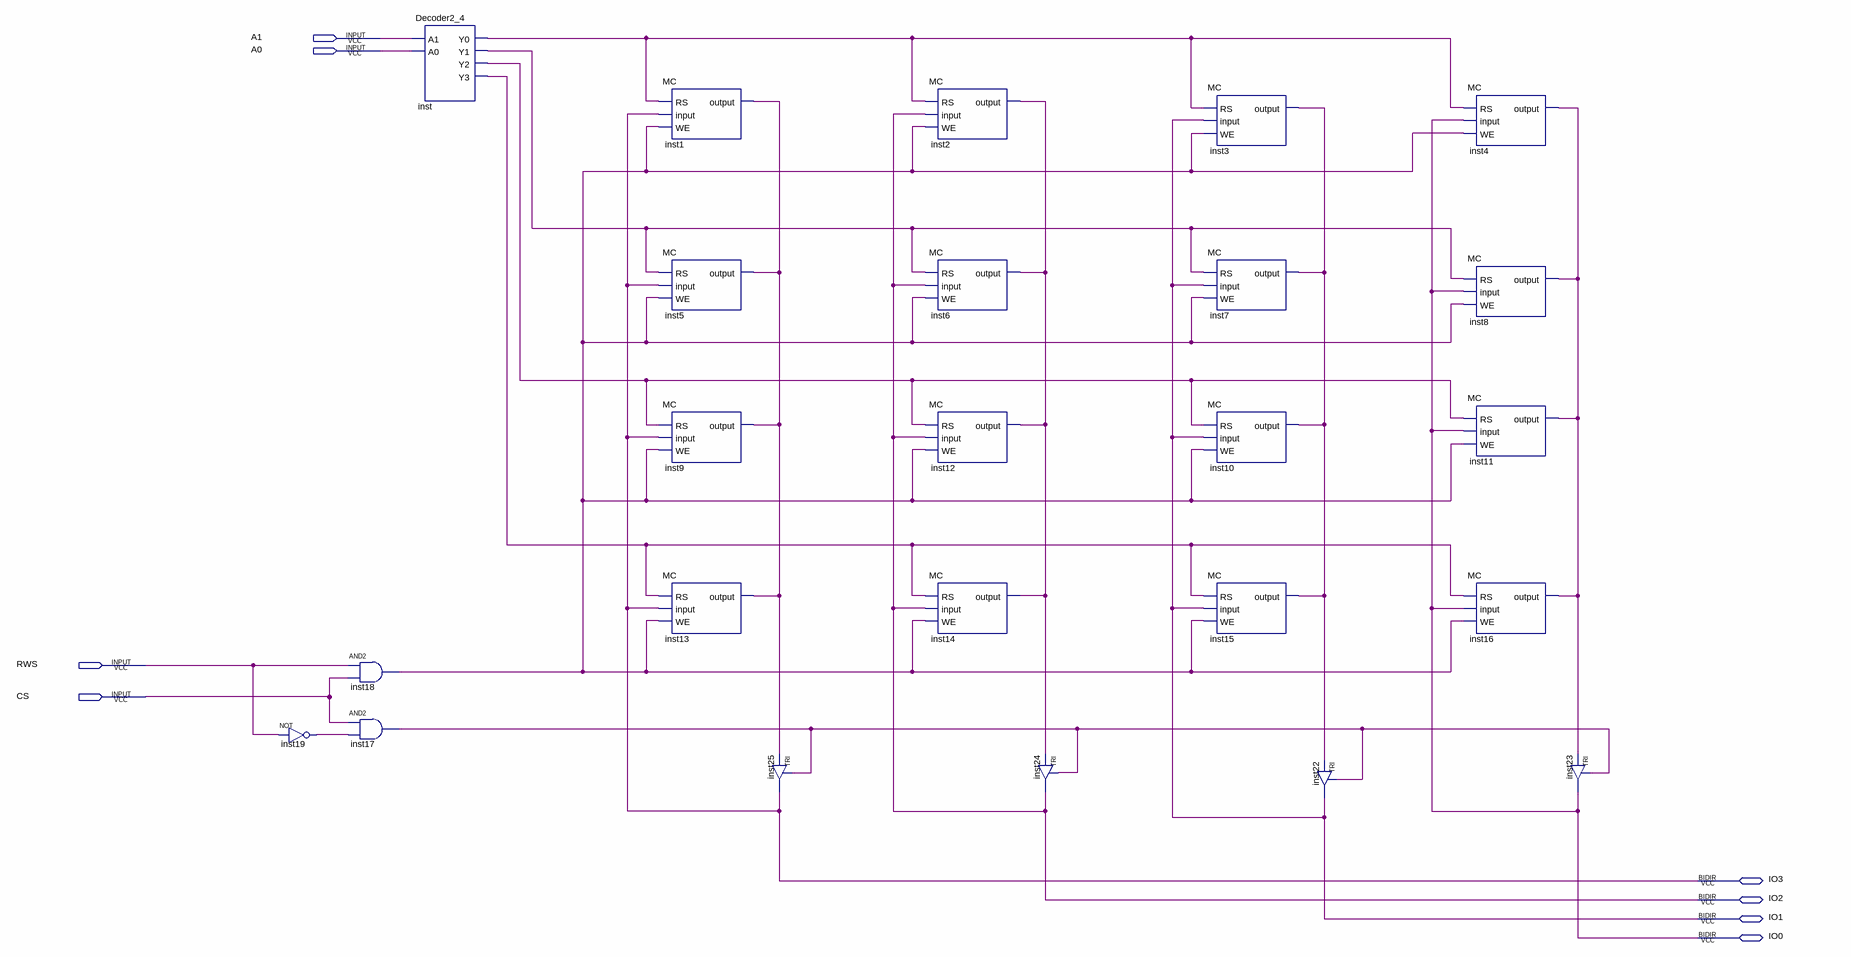
[diagram p0: schematic sheet]
// Quartus schematic RAM4_4.bdf as structural Verilog: 24 symbols, 8 pins
module RAM4_4 (
  input  A1,
  input  A0,
  input  RWS,
  input  CS,
  inout  IO3,
  inout  IO2,
  inout  IO1,
  inout  IO0
);

  wire inst1_output, inst2_output, inst3_output, inst4_output, inst17_out, inst18_out, inst19_out, inst_y0,
       inst_y1, inst_y2, inst_y3;

  not inst19 (inst19_out, RWS);
  and inst18 (inst18_out, RWS, CS);
  and inst17 (inst17_out, CS, inst19_out);
  Decoder2_4 inst (.A1(A1), .A0(A0), .Y0(inst_y0), .Y1(inst_y1), .Y2(inst_y2), .Y3(inst_y3));
  MC inst1 (.RS(inst_y0), .\input (IO3), .WE(inst18_out), .\output (inst1_output));
  MC inst5 (.RS(inst_y1), .\input (IO3), .WE(inst18_out), .\output (inst1_output));
  MC inst9 (.RS(inst_y2), .\input (IO3), .WE(inst18_out), .\output (inst1_output));
  MC inst13 (.RS(inst_y3), .\input (IO3), .WE(inst18_out), .\output (inst1_output));
  TRI inst25 (.IN(inst1_output), .OE(inst17_out), .OUT(IO3));
  MC inst2 (.RS(inst_y0), .\input (IO2), .WE(inst18_out), .\output (inst2_output));
  MC inst6 (.RS(inst_y1), .\input (IO2), .WE(inst18_out), .\output (inst2_output));
  MC inst12 (.RS(inst_y2), .\input (IO2), .WE(inst18_out), .\output (inst2_output));
  MC inst14 (.RS(inst_y3), .\input (IO2), .WE(inst18_out), .\output (inst2_output));
  TRI inst24 (.IN(inst2_output), .OE(inst17_out), .OUT(IO2));
  MC inst3 (.RS(inst_y0), .\input (IO1), .WE(inst18_out), .\output (inst3_output));
  MC inst7 (.RS(inst_y1), .\input (IO1), .WE(inst18_out), .\output (inst3_output));
  MC inst10 (.RS(inst_y2), .\input (IO1), .WE(inst18_out), .\output (inst3_output));
  MC inst15 (.RS(inst_y3), .\input (IO1), .WE(inst18_out), .\output (inst3_output));
  TRI inst22 (.IN(inst3_output), .OE(inst17_out), .OUT(IO1));
  MC inst4 (.RS(inst_y0), .\input (IO0), .WE(inst18_out), .\output (inst4_output));
  MC inst8 (.RS(inst_y1), .\input (IO0), .WE(inst18_out), .\output (inst4_output));
  MC inst11 (.RS(inst_y2), .\input (IO0), .WE(inst18_out), .\output (inst4_output));
  MC inst16 (.RS(inst_y3), .\input (IO0), .WE(inst18_out), .\output (inst4_output));
  TRI inst23 (.IN(inst4_output), .OE(inst17_out), .OUT(IO0));
endmodule
